# Altium schematic sheet EEG_photoresistor.SchDoc
size A4; SheetNumber: 1; SheetTotal: 1
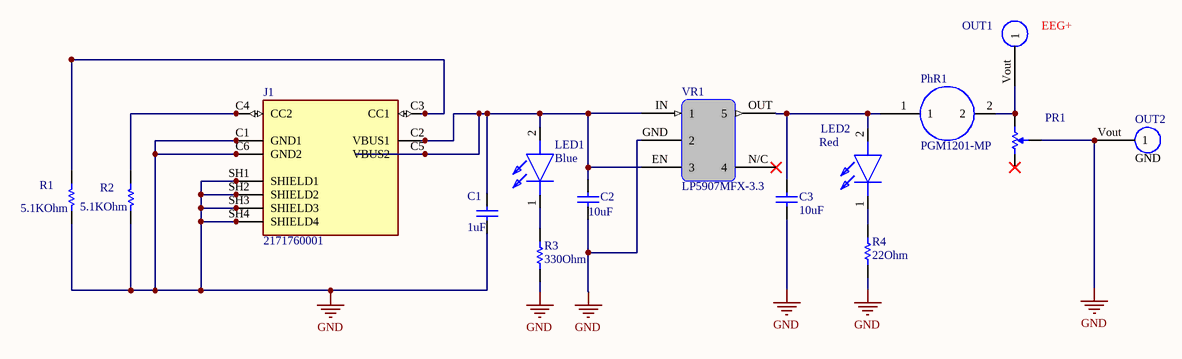
[diagram p0: EEG_photoresistor.SchDoc]

## Parts
C1  1uF  [MURA-0805_H_1.35_M]
C2  10uF  [MURA-0805_H_1.35_M]
C3  10uF  [MURA-0805_H_1.35_M]
J1  2171760001  [new]
LED1  Blue  [LEDC1005X35N]
LED2  Red  [LEDC1005X35N]
OUT1  EEG+  [VoutPad]
OUT2  GND  [VoutPad]
PhR1  PGM1201-MP  [PGM1201-MP]
PR1  3290W-1-203  [BOUR-3290W]  (value not drawn)
R1  5.1KOhm  [RESC1005X40X25ML05T05]
R2  5.1KOhm  [RESC1005X40X25ML05T05]
R3  330Ohm  [RESC1005X40X25ML05T05]
R4  22Ohm  [RESC1005X40X25ML05T05]
VR1  LP5907MFX-3.3  [LP5907MFX-3.3]

## Nets
GND: C1.1 C2.1 C3.1 J1.C1(GND1) J1.C6(GND2) J1.SH1(SHIELD1) J1.SH2(SHIELD2) J1.SH3(SHIELD3) J1.SH4(SHIELD4) OUT2.Vout(1) PR1.2 R1.2 R2.1 R3.1 R4.1 VR1.GND(2)
NetC1_2: C1.2 C2.2 J1.C2(VBUS1) J1.C5(VBUS2) LED1.2(A) VR1.EN(3) VR1.IN(1)
NetC3_2: C3.2 LED2.2(A) PhR1.1 VR1.OUT(5)
NetJ1_C3: J1.C3(CC1) R1.1
NetJ1_C4: J1.C4(CC2) R2.2
NetLED1_1: LED1.1(K) R3.2
NetLED2_1: LED2.1(K) R4.2
NetOUT1_Vout: OUT1.Vout(1) PhR1.2 PR1.3

Not connected (* = marked no-connect by the designer): PR1 1*; VR1 N/C(4)*

## Library data of the parts
C1 = CMP-2000-05254-1: CAP, Ceramic, 10 uF, 10%, 10 V, 0805, RoHS, Tape and Reel; Manufacturer: Murata; Manufacturer Number: GRM21BR61A106KE19L; Voltage - Rated: 10V; Product Training Modules: High-CapMultilayerCeramicCapacitors; Catalog Drawings: GRMSeries_0805_1.25; Temperature Coefficient: X5R; Online Catalog: GRMSeries; Featured Product: GA3SafetyRecognizedCapsandHi-CapMLCC; Capacitance: 1µF; Other Names: 490-1709-6; Applications: GeneralPurpose; Category: Capacitors; Datasheet Version: Aug-14; Datasheet URL: https://datasheet.ciiva.com/3777/210grm21br61a106ke1923-3777175.pdf; Ratings: -; Height - Seated (Max): -; Lead Spacing: -; Operating Temperature: -55degC~85degC; Features: -; Package Description: 2-Pin Surface Mount Device (0805), Body 2.1 x 1.35 mm; Standard Package: 1; Mounting Type: SurfaceMount,MLCC; Package Reference: 805; Tolerance: ±10%; Manufacturer URL: http://www.murata.com/; Size / Dimension: 0.079"Lx0.049"W(2.00mmx1.25mm); Packaging: Digi-Reel; Thickness (Max): 0.053"(1.35mm); Package / Case: 0805(2012Metric); Family: CeramicCapacitors; Series: GRM; Lead Style: -
C2 C3 = CMP-2000-05254-1: CAP, Ceramic, 10 uF, 10%, 10 V, 0805, RoHS, Tape and Reel; Manufacturer: Murata; Manufacturer Number: GRM21BR61A106KE19L; Voltage - Rated: 10V; Product Training Modules: High-CapMultilayerCeramicCapacitors; Catalog Drawings: GRMSeries_0805_1.25; Temperature Coefficient: X5R; Online Catalog: GRMSeries; Featured Product: GA3SafetyRecognizedCapsandHi-CapMLCC; Capacitance: 10µF; Other Names: 490-1709-6; Applications: GeneralPurpose; Category: Capacitors; Datasheet Version: Aug-14; Datasheet URL: https://datasheet.ciiva.com/3777/210grm21br61a106ke1923-3777175.pdf; Ratings: -; Height - Seated (Max): -; Lead Spacing: -; Operating Temperature: -55degC~85degC; Features: -; Package Description: 2-Pin Surface Mount Device (0805), Body 2.1 x 1.35 mm; Standard Package: 1; Mounting Type: SurfaceMount,MLCC; Package Reference: 805; Tolerance: ±10%; Manufacturer URL: http://www.murata.com/; Size / Dimension: 0.079"Lx0.049"W(2.00mmx1.25mm); Packaging: Digi-Reel; Thickness (Max): 0.053"(1.35mm); Package / Case: 0805(2012Metric); Family: CeramicCapacitors; Series: GRM; Lead Style: -
J1 = 2171760001: USB-C (USB TYPE-C) - Receptacle Connector 24 (6+18 Dummy) Position Surface Mount, Right Angle; Through Hole; MF: Molex; SnapEDA_Link: https://www.snapeda.com/parts/2171760001/Molex/view-part/?ref=snap; Package: None; Value: *; MP: 2171760001; Check_prices: https://www.snapeda.com/parts/2171760001/Molex/view-part/?ref=eda
LED1 LED2 = LTST-C281KGKT: LED; Manufacturer_Name: Lite-On; Datasheet Link: https://datasheet.lcsc.com/szlcsc/Lite-On-LTST-C281KGKT_C160479.pdf; Height: 0.35mm; Manufacturer_Part_Number: LTST-C281KGKT; Mouser Part Number: 859-LTST-C281KGKT; Mouser Price/Stock: https://www.mouser.co.uk/ProductDetail/Lite-On/LTST-C281KGKT?qs=xb8aMrBSZRJ6%2FVAKgwiAkw%3D%3D; Arrow Part Number: LTST-C281KGKT; Arrow Price/Stock: https://www.arrow.com/en/products/ltst-c281kgkt/lite-on-technology?region=nac
OUT1 OUT2 = Vout
PhR1 = PGM1201-MP: Photoresistor; 250mW; 4÷10kΩ; 560nm; THT; 250VDC; ØLED: 12mm; Manufacturer: Token; Manufacturer part number: PGM1201-MP; Datasheet link: https://www.datasheets.com/part-details/pgm1201-mp-token-electronics-industry-co---ltd-425268427#package
PR1 = CMP-2000-05581-1: Trimming Potentiometer, 20 KOhm, 1 W, -65 to 150 degC, 3-Pin THD, RoHS, Tube; Manufacturer: Bourns; No. of Turns: 25; Potentiometer Mounting: ThroughHole; Temperature Coefficient: ±50ppm/°C; Power Rating: 1W; SVHC: NoSVHC(15-Jun-2015); Resistance Tolerance: ±5%; Product Range: AEC-Q2003290WSeries; Track Resistance: 20kohm; Datasheet URL: http://www.bourns.com/docs/Product-Datasheets/3290.pdf; Datasheet Version: 04/2014; Mounting Technology: ThroughHole; Package Description: 3-Pin Through Hole Device, Body 9.53 x 3.81 mm, Pitch 2.54 mm; Manufacturer URL: http://www.bourns.com/; Package Reference: 3290W
R1-R4 = CMP-2002-00515-1: Chip Resistor, 330 Ohm, +/- 5%, 100 mW, -55 to 155 degC, 0402 (1005 Metric), RoHS, Tape and Reel; Manufacturer: Panasonic; Part Number: ERJ-2GEJ331X
VR1 = LP5907MFX-3.3: 250-mA Ultra-Low-Noise, Low-IQ LDO; Manufacturer Part Number: LP5907MFX-3.3/NOPB; Manufacturer: Texas Instruments; Supplier 1: Mouser; Supplier Part Number 1: 595-LP5907MFX-3.3NPB